# Altium schematic sheet STM32_DHT22.SchDoc
size A4; SheetNumber: 1; SheetTotal: 1
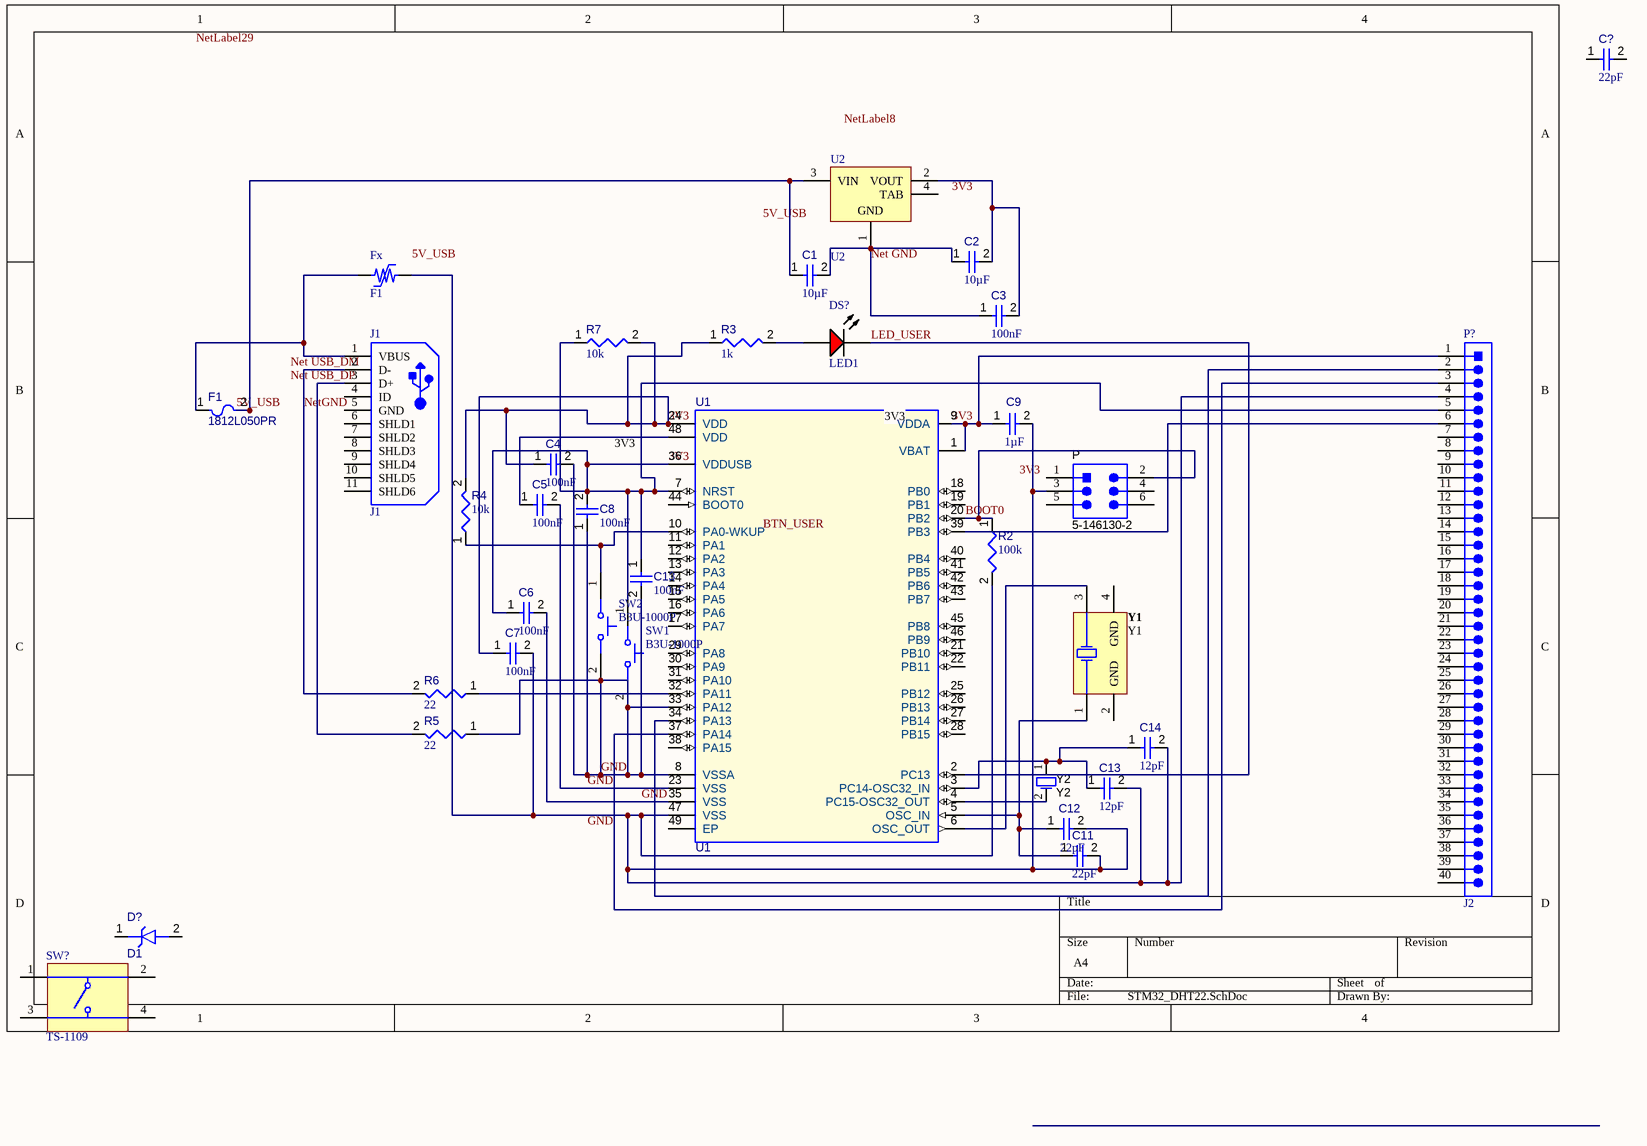
[diagram p0: STM32_DHT22.SchDoc]

## Parts
(Parts that share a designator on the sheet are numbered #1, #2 ... from top to bottom, then left to right.)
C1  value 10µF  [CAPC3216X180X50NL20T25]  (hidden comment: Capacitor 10 uF +/- 10% 16 V 1206)
C2  value 10µF  [CAPC3216X180X50NL20T25]  (hidden comment: Capacitor 10 uF +/- 10% 16 V 1206)
C3  value 100nF  [CAPC2013X95X50LL10T25]  (hidden comment: Capacitor 100 nF +/-10% 50 V 0805)
C4  value 100nF  [CAPC2013X95X50LL10T25]  (hidden comment: Capacitor 100 nF +/-10% 50 V 0805)
C5  value 100nF  [CAPC2013X95X50LL10T25]  (hidden comment: Capacitor 100 nF +/-10% 50 V 0805)
C6  value 100nF  [CAPC2013X95X50LL10T25]  (hidden comment: Capacitor 100 nF +/-10% 50 V 0805)
C7  value 100nF  [CAPC2013X95X50LL10T25]  (hidden comment: Capacitor 100 nF +/-10% 50 V 0805)
C8  value 100nF  [CAPC2013X95X50LL10T25]  (hidden comment: Capacitor 100 nF +/-10% 50 V 0805)
C9  value 1µF  [CAPC1608X94X35NL15T15]  (hidden comment: Capacitor 1 uF +/- 10% 16 V 0603)
C11  value 22pF  [CAPC0402(1005)60_L]  (hidden comment: Capacitor 22pF +/-10% 50V 0402)
C12  value 22pF  [CAPC0402(1005)60_L]  (hidden comment: Capacitor 22pF +/-10% 50V 0402)
C13#1  value 100nF  [CAPC2013X95X50LL10T25]  (hidden comment: Capacitor 100 nF +/-10% 50 V 0805)
C13#2  value 12pF  [CAPC0402(1005)33_L]  (hidden comment: Capacitor 12pF +/-10% 50V 0402)
C14  value 12pF  [CAPC0402(1005)33_L]  (hidden comment: Capacitor 12pF +/-10% 50V 0402)
C?  value 22pF  [CAPC0402(1005)60_L]  (hidden comment: Capacitor 22pF +/-10% 50V 0402)
D?  D1  [STM-QFN1610]
DS?  LED1  [LTST-C191KRKT_V]
F1  1812L050PR  [LFUS-1812L050_V]
Fx  F1  [BOUR-MF-MSMF050-2_V]
J1  J1  [FCI-10103594-0001LF_V]
P  5-146130-2  [TECO-5-146130-2_V]
P?  J2  [TECO-9-146281-0_V]
R2  value 100k  [RESC1005X40X25ML05T05]  (hidden comment: Resistor 100k +/-1% 0402 63 mW)
R3  value 1k  [RESC1608X55X25ML10T15]  (hidden comment: Resistor 1k +/-1% 0603 100 mW)
R4  value 10k  [RESC1005X40X25ML05T05]  (hidden comment: Resistor 10k +/-1% 0402 100 mW)
R5  value 22  [RESC1609X50X30ML08T20]  (hidden comment: Resistor 22R +/-1% 0603 100 mW)
R6  value 22  [RESC1609X50X30ML08T20]  (hidden comment: Resistor 22R +/-1% 0603 100 mW)
R7  value 10k  [RESC1005X40X25ML05T05]  (hidden comment: Resistor 10k +/-1% 0402 100 mW)
SW1  B3U-1000P  [OMRON-B3U-1000_V]
SW2  B3U-1000P  [OMRON-B3U-1000_V]
SW?  TS-1109  [BEST-TS-1109_V]
U1  U1  [STM-UFQFPN48_N]
U2  U2  [STM-SOT-223_M]
Y1  Y1  [TXC-7B-4_V]
Y2  Y2  [ABRA-ABS07-2_V]

## Nets
3V3: C4.1 C6.1 C7.1 C8.2 C9.1 C13#1.1 P?.1 P?.5 R3.1 R4.2 R7.1 R7.2 SW1.1 U1.1(VBAT) U1.7(NRST) U1.9(VDDA) U1.24(VDD) U1.36(VDDUSB)
5V_USB: C1.1 F1.2 U2.3(VIN)
BOOT0: P.2 R2.1 U1.20(PB2)
GND: C4.2 C5.2 C6.2 C8.1 C13#1.2 R5.1 SW1.2 SW2.2 U1.8(VSSA) U1.23(VSS) U1.33(PA12) U1.35(VSS)
LED_USER: DS?.2(K) U1.2(PC13)
Net GND: C1.2 C2.1 C3.1 U2.1(GND)
NetGND: J1.2(D-) R6.2
NetC2_2: C2.2 C3.2 U2.2(VOUT)
NetC5_1: C5.1 U1.48(VDD)
NetC7_2: C7.2 C9.2 C11.2 C12.2 C13#2.2 C14.2 Fx.2 P.3 P?.4 R2.2 U1.47(VSS)
NetC11_1: C11.1 C12.1 U1.5(OSC_IN) Y1.1(X1)
NetC13#2_1: C13#2.1 C14.1 U1.3(PC14-OSC32_IN) Y2.1(OSC1)
NetDS?_1: DS?.1(A) R3.2
NetF1_1: F1.1 Fx.1 J1.1(VBUS)
NetJ1_3: J1.3(D+) R5.2
NetP?_2: P?.2 U1.34(PA13)
NetP?_3: P?.3 U1.37(PA14)
NetP?_6: P?.6 U1.39(PB3)
NetR4_1: R4.1 SW2.1 U1.10(PA0-WKUP)
NetR6_1: R6.1 U1.32(PA11)
NetU1_4: U1.4(PC15-OSC32_OUT) Y2.2(OSC2)
NetU1_6: U1.6(OSC_OUT) Y1.3(X2)

Not connected (* = marked no-connect by the designer): C? 1 2; D? 1(A) 2(A); J1 4(ID) 5(GND) 6(SHLD1) 7(SHLD2) 8(SHLD3) 9(SHLD4) 10(SHLD5) 11(SHLD6); P 1 4 5 6; P? 7 8 9 10 11 12 13 14 15 16 17 18 19 20 21 22 23 24 25 26 27 28 29 30 31 32 33 34 35 36 37 38 39 40; SW? 1 2 3 4; U1 11(PA1) 12(PA2) 13(PA3) 14(PA4) 15(PA5) 16(PA6) 17(PA7) 18(PB0) 19(PB1) 21(PB10) 22(PB11) 25(PB12) 26(PB13) 27(PB14) 28(PB15) 29(PA8) 30(PA9) 31(PA10) 38(PA15) 40(PB4) 41(PB5) 42(PB6) 43(PB7) 44(BOOT0) 45(PB8) 46(PB9) 49(EP); U2 4(TAB); Y1 2(GND) 4(GND)

## Notes on the sheet
- 3V3
- (near U1) 3V3
- Labels drawn without touching a wire or pin: 3V3, 5V_USB, BTN_USER, GND, Net USB_DM, Net USB_DP, NetLabel8, NetLabel29

## Library data of the parts
C1 C2 = CMP-001-00016-6: Chip Capacitor, 10 uF, +/- 10%, 16 V, 1206 (3216 Metric); Capacitor Type: Ceramic; Voltage Rating: 16V; Tolerance: 10%; Min Operating Temperature: -55°C; Pins: 2; Mounting Technology: SM; Case/Package: 1206; Max Operating Temperature: 125°C; RoHS Compliant: True
C3-C8 C13#1 = CMP-001-00018-6: Chip Capacitor, 100 nF, +/- 10%, 50 V, 0805 (2012 Metric); Capacitor Type: Ceramic; Voltage Rating: 50V; Pins: 2; Max Operating Temperature: 125°C; Min Operating Temperature: -55°C; Mounting Technology: SM; Case/Package: 0805; RoHS Compliant: True; Tolerance: 10%
C9 = CMP-001-00003-6: Chip Capacitor, 1 uF, +/- 10%, 16 V, 0603 (1608 Metric); Voltage Rating: 16V; Capacitor Type: Ceramic; Max Operating Temperature: 125°C; Pins: 2; Tolerance: 10%; Min Operating Temperature: -55°C; RoHS Compliant: True; Mounting Technology: SM; Case/Package: 0603
C11 C12 C? = CMP-001-00073-3: Chip Capacitor, 22pF +/-10%, 50V, 0402, Thickness 0.6 mm; Tolerance: 10%; Pins: 2; Voltage Rating: 50V; Max Operating Temperature: 85°C; Min Operating Temperature: -55°C; Mounting Technology: SMT; Case/Package: 0402
C13#2 C14 = CMP-001-00072-4: Chip Capacitor, 12pF +/-10%, 50V, 0402, Thickness 0.33 mm; Tolerance: 20%; Pins: 2; Max Operating Temperature: 85°C; Case/Package: 0402; Voltage Rating: 50V; Mounting Technology: SMT; Min Operating Temperature: -55°C
D? = CMP-004-00023-3: TVS DIODE 22V 41V 1610; Peak Inverse Voltage: 23.3V; Max Surge Current: 35A; Mounting Technology: SMT; Case/Package: QFN1610 (0603); RoHS Compliant: Yes; Pins: 2
DS? = CMP-007-00024-2: LED Uni-Color Red, 62.5 mW, 25 mA, -30 to 85 degC, 2-Pin SMD, RoHS, Tape and Reel; Manufacturer: Lite-On; Power: 75mW; Forward Voltage: 2V; Luminous Intensity: 54mcd; Lens Style: Diffused; Viewing Angle: 130degrees; Forward Current: 20mA; Manufacturer URL: http://www.us.liteon.com/; Case/Package: 0603; Datasheet Version: Rev. F, 05/2013; Package Reference: C191KRKT; Datasheet URL: http://optoelectronics.liteon.com/upload/download/DS-22-99-0151/S_110_LTST-C190KRKT.pdf; Package Description: 2-Pin Surface Mount Device, Body 1.6 x 0.8 mm; Nominal Vf: 2V; Packaging: TapeandReel; RoHS Compliant: True; Pins: 2; Illumination Colour: Red; Colour: Red; Mounting Technology: SM; Package Quantity: 3000; Min Operating Temperature: -55°C; Max Operating Temperature: 85°C
F1 = CMP-005-00004-3: POLY-FUSE(R) Resettable PTC, 15 V, 0.5 A, -40 to 85 degC, 2-Pin SMD, RoHS, Tape and Reel; Manufacturer: Littelfuse; Nominal Supply Voltage: 15V; Resistance: 1Ohm; Current Rating: 100A; Min Operating Temperature: -40°C; Package Description: 2-Pin Surface Mount Device, Body 4.55 x 3.24 mm; Package Quantity: 1; RoHS Compliant: True; Datasheet Version: Feb-16; Datasheet URL: http://www.littelfuse.com/~/media/electronics/datasheets/resettable_ptcs/littelfuse_ptc_1812l_datasheet.pdf.pdf; Case/Package: 1812; Packaging: TapeandReel; Voltage Rating: 15V; Max Operating Temperature: 85°C; Package Reference: 1812; Mounting Technology: SM
Fx = CMP-005-00001-4: PTC Resettable Fuse, 15 V, 500 mA, -40 to 85 degC, 2-Pin SMD, RoHS, Tape and Reel; Manufacturer: Bourns; Nominal Supply Voltage: 15V; Current Rating: 100A; Resistance: 150mohm; Datasheet URL: http://www.bourns.com/docs/Product-Datasheets/mfmsmf.pdf; Packaging: TapeandReel; Package Description: 2-Pin Surface Mount Device, Body 4.55 x 3.24 mm; RoHS Compliant: True; Package Quantity: 2000; Lead Pitch: 4.73mm; Datasheet Version: Rev. AG, 08/2016; Max Operating Temperature: 85°C; Voltage Rating: 15V; Mounting Technology: SM; Case/Package: 1812; Min Operating Temperature: -40°C; Package Reference: MF-MSMF050-2
J1 = CMP-002-00038-2: Micro USB 2.0 B Receptacle, 5 Position, Height 3.24 mm, -55 to 85 degC, RoHS, Tape and Reel; Manufacturer: FCI Electronics; Gender: Female; Current Rating: 1.8A; Voltage Rating: 100V; Min Operating Temperature: -55°C; Package Reference: FCI-10103594-0001LF; Max Operating Temperature: 85°C; Lead Pitch: 0.65mm; Case/Package: FCI-10103594-0001LF; Package Quantity: 1500; Connector Type: USB; Mounting Technology: SM; Datasheet Version: Rev. A, 06/2010; Contact Material: Copper; Package Description: 5-Pin Surface Mount Device, Body 8.04 x 5.62 mm; Contact Plating: Gold; Packaging: TapeandReel; Datasheet URL: http://portal.fciconnect.com/Comergent//fci/drawing/10103594.pdf; Pins: 5; RoHS Compliant: True; Manufacturer URL: http://portal.fciconnect.com/
P = CMP-002-00018-2: Male Header, Pitch 2.54 mm, 2 x 3 Position, Height 8.13 mm, -65 to 125 degC, RoHS, Tube; Manufacturer: TE Connectivity; Max Operating Temperature: 125°C; Datasheet Version: Oct-15; Package Description: Male Header, Pitch 2.54 mm, 2 x 3 Position, Height 8.13 mm; Case/Package: 5-146130-2; Datasheet URL: http://www.te.com/commerce/DocumentDelivery/DDEController?Action=showdoc&DocId=Customer+Drawing%7F146130%7FM%7Fpdf%7FEnglish%7FENG_CD_146130_M.pdf%7F5-146130-2; Manufacturer URL: http://www.te.com/; Connector Type: Header; Gender: Male; Mounting Technology: SM; Min Operating Temperature: -65°C; RoHS Compliant: Unknown; Package Reference: 5-146130-2
P? = CMP-002-00022-2: Male Header, Pitch 2.54 mm, 1 x 40 Position, Height 8.21 mm, Tail Length 3.05 mm, -65 to 105 degC, RoHS, Bulk; Manufacturer: TE Connectivity; Current Rating: 3A; Rows: 1; Datasheet URL: http://www.te.com/commerce/DocumentDelivery/DDEController?Action=showdoc&DocId=Customer+Drawing%7F146281%7FG%7Fpdf%7FEnglish%7FENG_CD_146281_G_146281_1_c.dwg.pdf%7F9-146281-0; Contact Plating: Gold; Packaging: Tray; Lead Pitch: 2.54mm; Max Operating Temperature: 105°C; Manufacturer URL: http://www.te.com/; Connector Type: Header; Package Reference: 9-146281-0; Gender: Male; Package Description: Male Header, Pitch 2.54 mm, 1 x 40 Position, Height 8.21 mm, Tail Length 3.05 mm; Package Quantity: 100; Datasheet Version: Rev. G, 07/2014; Contact Gender: Male; Colour: Black; RoHS Compliant: True; Min Operating Temperature: -65°C; Mounting Technology: TH; Contact Material: Bronze; Package URL: http://www.te.com/commerce/DocumentDelivery/DDEController?Action=showdoc&DocId=Catalog+Section%7F1307819_SECTION_5%7F0908%7Fpdf%7FEnglish%7FENG_CS_1307819_SECTION_5_0908.pdf%7F9-146281-0; Case/Package: 9-146281-0; Contact Finish: Gold; Pins: 40
R2 = CMP-009-00021-5: Chip Resistor, 100 KOhm, +/- 1%, 0.063 W, -55 to 155 degC, 0402 (1005 Metric); Voltage Rating: 50V; Power: 63mW; Pins: 2; Tolerance: 1%; Max Operating Temperature: 155°C; Case/Package: 0402; Min Operating Temperature: -55°C; Mounting Technology: SM; RoHS Compliant: True
R3 = CMP-009-00014-5: Chip Resistor, 1 KOhm, +/-1%, 0.1 W, -55 to 155 degC, 0603 (1608 Metric); Voltage Rating: 50V; Power: 100mW; Tolerance: 1%; Mounting Technology: SM; Pins: 2; Case/Package: 0603; Min Operating Temperature: -55°C; RoHS Compliant: True; Max Operating Temperature: 155°C
R4 R7 = CMP-009-00015-5: Chip Resistor, 10 KOhm, +/- 1%, 0.1 W, -55 to 155 degC, 0402 (1005 Metric); Voltage Rating: 50V; Power: 100mW; Case/Package: 0402; RoHS Compliant: True; Min Operating Temperature: -55°C; Mounting Technology: SM; Tolerance: 1%; Max Operating Temperature: 155°C; Pins: 2
R5 R6 = CMP-009-00027-5: Chip Resistor, 22 Ohm, +/- 1%, 100 mW, -55 to 155 degC, 0603 (1608 Metric); Power: 100mW; Voltage Rating: 75V; Max Operating Temperature: 155°C; Min Operating Temperature: -55°C; Tolerance: 1%; RoHS Compliant: True; Mounting Technology: SM; Case/Package: 0603; Pins: 2
SW1 SW2 = CMP-011-00000-2: Tactile Switch, SPST-NO, 0.05 A, 12 V, -25 to 70 degC, 2-Pin SMD, RoHS, Tape and Reel; Manufacturer: Omron Electronic Components; IP Rating: IP40; Current Rating: 50mA; Max Contact Resistance: 100mohm; Operating Force: 153gf; Throw Configuration: SPST; Resistance: 0.1Ohm; Max Voltage Rating (DC): 12V; Contact Material: Silver; Max Current Rating: 50mA; Datasheet URL: http://www.omron.com/ecb/products/pdf/en-b3u.pdf; Mounting Technology: SM; Case/Package: B3U-1000; Packaging: TapeandReel; Package Reference: B3U-1000; Manufacturer URL: http://www.omron.com/; Datasheet Version: Jan-15; RoHS Compliant: True; Max Operating Temperature: 70°C; Contact Current Rating: 50mA; Package Quantity: 3500; Package Description: 2-Pin Surface Mount Device, Body 3 x 2.5 mm; Voltage Rating (DC): 12V; Min Operating Temperature: -25°C; Voltage Rating: 12V
SW? = CMP-011-00002-2: Tactile Switch, SPST, 12 V, 50 mA, -20 to 80 degC, 4-Pin THD; Manufacturer: Shenzhen Best; RoHS Compliant: Unknown; Manufacturer URL: www.best-dz.com/; Case/Package: TS-1109; Package Reference: TS-1109; Datasheet Version: Dec-12; Mounting Technology: TH; Package Description: 4-Pin Through Hole Device, Body 6.2 x 6.2 mm; Datasheet URL: http://datasheet.octopart.com/TS-1109-Best-Inc.-datasheet-30458100.pdf
U1 = CMP-020-00022-3: ARM® Cortex®-M4 STM32L4 Microcontroller IC 32-Bit 80MHz 512KB (512K x 8) FLASH 48-UFQFPN (7x7); I/Os: 38; RAM Size: 160; Min Supply Voltage: 2V; ComponentLink1URL: http://www.st.com/; ComponentLink2Description: Datasheet; Mounting Technology: Surface Mount; ComponentLink2URL: http://www.st.com/st-web-ui/static/active/en/resource/technical/document/datasheet/CD00161566.pdf; Case/Package: UFQFN-48; Pins: 49; RoHS Compliant: Yes; ComponentLink1Description: Manufacturer URL
U2 = CMP-019-00006-3: Fixed Low Drop Positive Voltage Regulator, 5 V, 0 to 125 degC, 4-Pin SOT223, RoHS, Tape and Reel; Manufacturer: STMicroelectronics; Max Input Voltage: 15V; Min Supply Voltage: 6.5V; Max Ouput Current: 1.3A; Output Voltage: 5V; Output Current: 950mA; Dropout Voltage: 1.1V; Power: 12W; Outputs: 1; Packaging: TapeandReel; Datasheet URL: http://www.st.com/content/ccc/resource/technical/document/datasheet/99/3b/7d/91/91/51/4b/be/CD00000544.pdf/files/CD00000544.pdf/jcr:content/translations/en.CD00000544.pdf; Package Reference: SOT-223; RoHS Compliant: True; Datasheet Version: Nov-13; Min Operating Temperature: 0°C; Case/Package: TO-261-4; Pins: 4; Manufacturer URL: http://www.st.com/; Mounting Technology: SM; Package Quantity: 2500; Nominal Output Voltage: 5V; Max Supply Voltage: 15V; Min Input Voltage: 6.5V; Max Operating Temperature: 125°C; Package Description: 4-Pin Small Outline Transistor, Body 6.5 x 3.5 mm, Pitch 2.3 mm
Y1 = CMP-003-00013-2: SMD Seam Sealing Crystal, 8 MHz, +/- 30 ppm, 18 pF, -10 to 70 degC, 4-Pin SMD, RoHS, Tape and Reel; Manufacturer: TXC; Frequency: 8MHz; Resistance: 100Ohm; Tolerance: 30ppm; Load Capacitance: 18pF; ESR: 100; Package Quantity: 1000; Datasheet URL: http://www.txccorp.com/download/products/quartz_crystals/2015TXC_7B_19.pdf; Case/Package: 7B-4; Packaging: TapeandReel; Frequency Tolerance: 30ppm; Min Operating Temperature: -20°C; RoHS Compliant: True; Package Reference: 7B-4; Mounting Technology: SM; Datasheet Version: Jul-15; Max Operating Temperature: 70°C; Package Description: 4-Pin Surface Mount Device, Body 5 x 3.2 mm, Pitch 3.7 mm; Pins: 4
Y2 = CMP-003-00022-2: Low Profile Crystal, 32.768 kHz, +/- 20 ppm, 12.5 pF, -40 to 85 degC, 2-Pin SMD, Pb-Free, Tape and Reel; Manufacturer: Abracon; Frequency Tolerance: 20ppm; ESR: 70k; Load Capacitance: 12.5pF; Max Operating Temperature: 85°C; Mounting Technology: SM; Manufacturer URL: http://www.abracon.com/; Pins: 2; Packaging: TapeandReel; Tolerance: 20ppm; Min Operating Temperature: -40°C; Frequency: 32.768kHz; Datasheet URL: http://www.abracon.com/Resonators/ABS07.pdf; RoHS Compliant: True; Package Description: 2-Pin Surface Mount Device, Body 3.2 x 1.5 mm; Datasheet Version: Aug-15; Package Reference: ABS07-2; Package URL: http://www.abracon.com/Support/PackageDrawing/Resonators/ABS07.PDF; Package Quantity: 3000; Case/Package: CSMD